# EAGLE design LT3652_PCB (EAGLE 8.6.3)
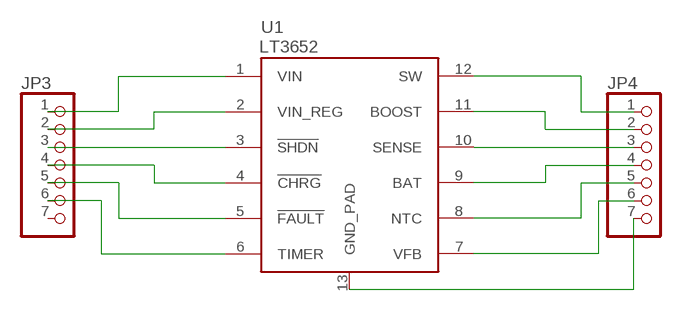
[diagram p0: schematic, sheet 1]

## Parts
JP3  PINHD-1X7  [1X07]
JP4  PINHD-1X7  [1X07]
U1  LT3652  [MSOP-12_GND]

## Nets
N$1: JP3.1 U1.1(VIN)
N$2: JP3.2 U1.2(VIN_REG)
N$3: JP3.3 U1.3(!SHDN)
N$4: JP3.4 U1.4(!CHRG)
N$5: JP3.5 U1.5(!FAULT)
N$6: JP3.6 U1.6(TIMER)
N$7: JP4.1 U1.12(SW)
N$8: JP4.2 U1.11(BOOST)
N$9: JP4.3 U1.10(SENSE)
N$10: JP4.4 U1.9(BAT)
N$11: JP4.5 U1.8(NTC)
N$12: JP4.6 U1.7(VFB)
N$15: JP4.7 U1.13(GND_PAD)
Unconnected: JP3.7

## Library data of the parts
JP3 JP4 = pinhead:PINHD-1X7: PIN HEADER
U1 = SparkFun-IC-Power:LT3652: LT3652 MPPT Solar Charge Controller(IC-11822) 5V-32V smart charger for batteries up to 14.4V

## Board
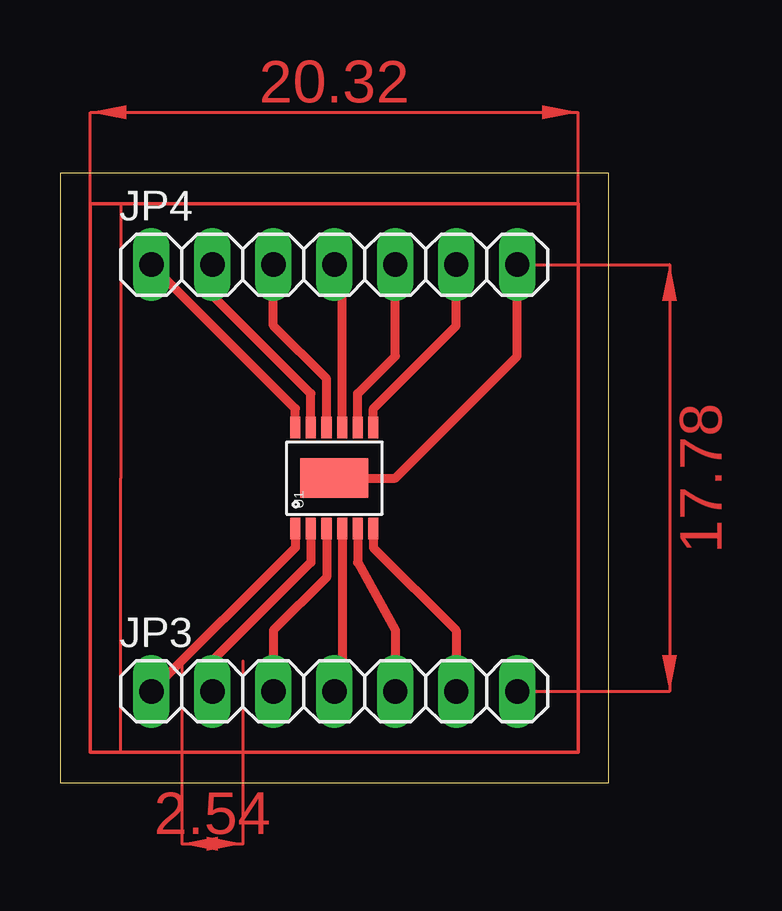
[diagram p1: board, top side]

Size 22.86 x 25.39 mm. Coordinates in mm from the lower left corner, seen from the top.
Outline: 0,0 22.86,0 22.86,25.39 0,25.39 0,0
Copper layers (1*16): Top 0.035mm / dielectric 1.5mm / Bottom 0.035mm
Design rules "default": minimum track width 6mil, minimum drill 0.35mm, track to track 6mil, track to pad 6mil, pad to pad 6mil, via to via 6mil, smd to smd 6mil, copper to edge 40mil, drill to drill 6mil, minimum pad ring 10mil, minimum via ring 8mil, stop-mask expansion 4mil, vias tented up to drill 0mil, thermal gap 10mil

### Footprints (pad centres in the part's own frame; a part is rotated, then mirrored left to right if it is on the bottom)
1X07 = drill 1.016 long: 1 -7.62,0; 2 -5.08,0; 3 -2.54,0; 4 0,0; 5 2.54,0; 6 5.08,0; 7 7.62,0
MSOP-12_GND = smd 0.889 x 0.42: 1 -2.1,1.625; 2 -2.1,0.975; 3 -2.1,0.325; 4 -2.1,-0.325; 5 -2.1,-0.975; 6 -2.1,-1.625; 7 2.1,-1.625; 8 2.1,-0.975; 9 2.1,-0.325; 10 2.1,0.325; 11 2.1,0.975; 12 2.1,1.625 | smd 1.651 x 2.845: 13 0,0

### Placement (x,y rotation side)
JP3  11.43,3.81 0 top
JP4  11.43,21.59 0 top
U1  11.43,12.7 90 top

### Tracks (layer width: path | path; a pad name or v marks a point on that pad's centre or on a via)
N$1
  Top 0.381: U1.1 9.8,9.8 JP3.1
N$2
  Top 0.381: U1.2 10.46,9.18 6.35,5.08 JP3.2
N$3
  Top 0.381: U1.3 11.11,8.57 8.89,6.35 JP3.3
N$4
  Top 0.381: U1.4 11.76,3.81 JP3.4
N$5
  Top 0.381: U1.5 12.4,9.18 13.97,6.35 JP3.5
N$6
  Top 0.381: U1.6 13.05,9.8 16.51,6.35 JP3.6
N$7
  Top 0.381: U1.12 9.8,15.6 JP4.1
N$8
  Top 0.381: U1.11 10.46,16.21 6.35,20.32 JP4.2
N$9
  Top 0.381: U1.10 11.11,16.84 8.89,19.05 JP4.3
N$10
  Top 0.381: U1.9 11.76,21.27 JP4.4
N$11
  Top 0.381: U1.8 12.4,16.21 13.97,17.78 JP4.5
N$12
  Top 0.381: U1.7 13.05,15.6 16.51,19.05 JP4.6
N$13
  Top 0.152: 1.27,1.27 1.27,24.13 21.59,24.13 21.59,1.27 1.27,1.27
N$15
  Top 0.381: U1.13 13.97,12.7 19.05,17.78 JP4.7
(copper drawn outside any net)
  shapes: Top area x4